# Altium schematic sheet PUSHBUTTONS.SchDoc: PUSHBUTTON
size A3; Author: Silvio Navaretti; CompanyName: ARDUINO; DrawnBy: Silvio Navaretti; Engineer: Silvio Navaretti; Organization: ARDUINO; SheetNumber: 49; SheetTotal: 51; RevAuthor: Silvio Navaretti
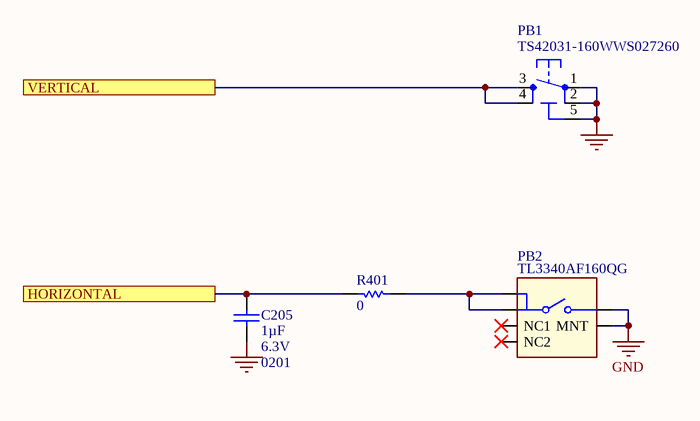
[diagram p0: PUSHBUTTONS.SchDoc]

## Parts
C205  value 1µF  Voltage: 6.3V  Case Code (Imperial): 0201  [CAP-0201]  (hidden comment: GRM033R60J105MEA2D)
PB1  TS42031-160WWS027260  [TS42]
PB2  TL3340AF160QG  [TL3340AF160QG-Footprint-1]
R401  value 0  [RES-0201]  (hidden comment: CRCW02010000Z0ED)

## Ports
HORIZONTAL, VERTICAL

## Nets
GND: C205.1 PB1.1 PB1.2 PB1.5(5-GND) PB2.2 PB2.MNT
HORIZONTAL: C205.2 R401.1 ; port HORIZONTAL
VERTICAL: PB1.3 PB1.4 ; port VERTICAL
NetPB2_1: PB2.1 PB2.3 R401.2

Not connected (* = marked no-connect by the designer): PB2 NC1* NC2*

## Notes on the sheet
- Title:
- ID:
- Date:
- Time:
- Version:
- Sheet
- of
- RevAuthor:
- Reference Designs ARE PROVIDED "AS IS" AND "WITH ALL FAULTS. Arduino SA DISCLAIMS ALL OTHER WARRANTIES, EXPRESS OR IMPLIED, REGARDING PRODUCTS, INCLUDING BUT NOT LIMITED TO, ANY IMPLIED WARRANTIES OF MERCHANTABILITY OR FITNESS FOR A PARTICULAR PURPOSE.
  Arduino SA may make changes to specifications and product descriptions at any time, without notice. The Customer must not rely on the absence or characteristics of any features or instructions marked "reserved" or "undefined".
  Arduino SA reserves these for future definition and shall have no responsibility whatsoever for conflicts or incompatibilities arising from future changes to them. The product information on the Web Site or Materials is subject to change without notice.
  Do not finalize a design with this info. ARDUINO and other Arduino brands and logos and Trademarks of Arduino SA. All Arduino SA Trademarks cannot be used without owner's formal permission.
- File:
- Author:

## Library data of the parts
C205 = C0002-A.15: CAP CHIP 0201 1uF 20% 6.3V X5R; Manufacturer: Murata; Code Arduino: A5520; Tolerance: 20%; Dielectric: X5R; Part Number: GRM033R60J105MEA2D; Technology: Ceramic
PB1 = B0005-A.11: PUSHBUTTON SMD 6x6 5 PINS; Manufacturer: C&K; Code Arduino: 0946; Part Number: TS42031-160WWS027260
PB2 = B0013-A.8: PUSHBUTTON SMD VERTICAL ANCHORS 4x3.4mm; Manufacturer: E-Switch; Code Arduino: B0013; Max Operating Temperature: 85°C; Mount: Surface Mount; Min Operating Temperature: -35°C; Part Number: TL3340AF160QG
R401 = R0140-A.21: RES CHIP 0201 0R; Manufacturer: Vishay; Tolerance: 0%; Temperature coefficient: 0ppm; Power: 50mW; Code Arduino: R0140; Part Number: CRCW02010000Z0ED; Case Code (Imperial): 0201; Technology: Thick film